# Altium project RT1064_MainBoard.PrjPcb
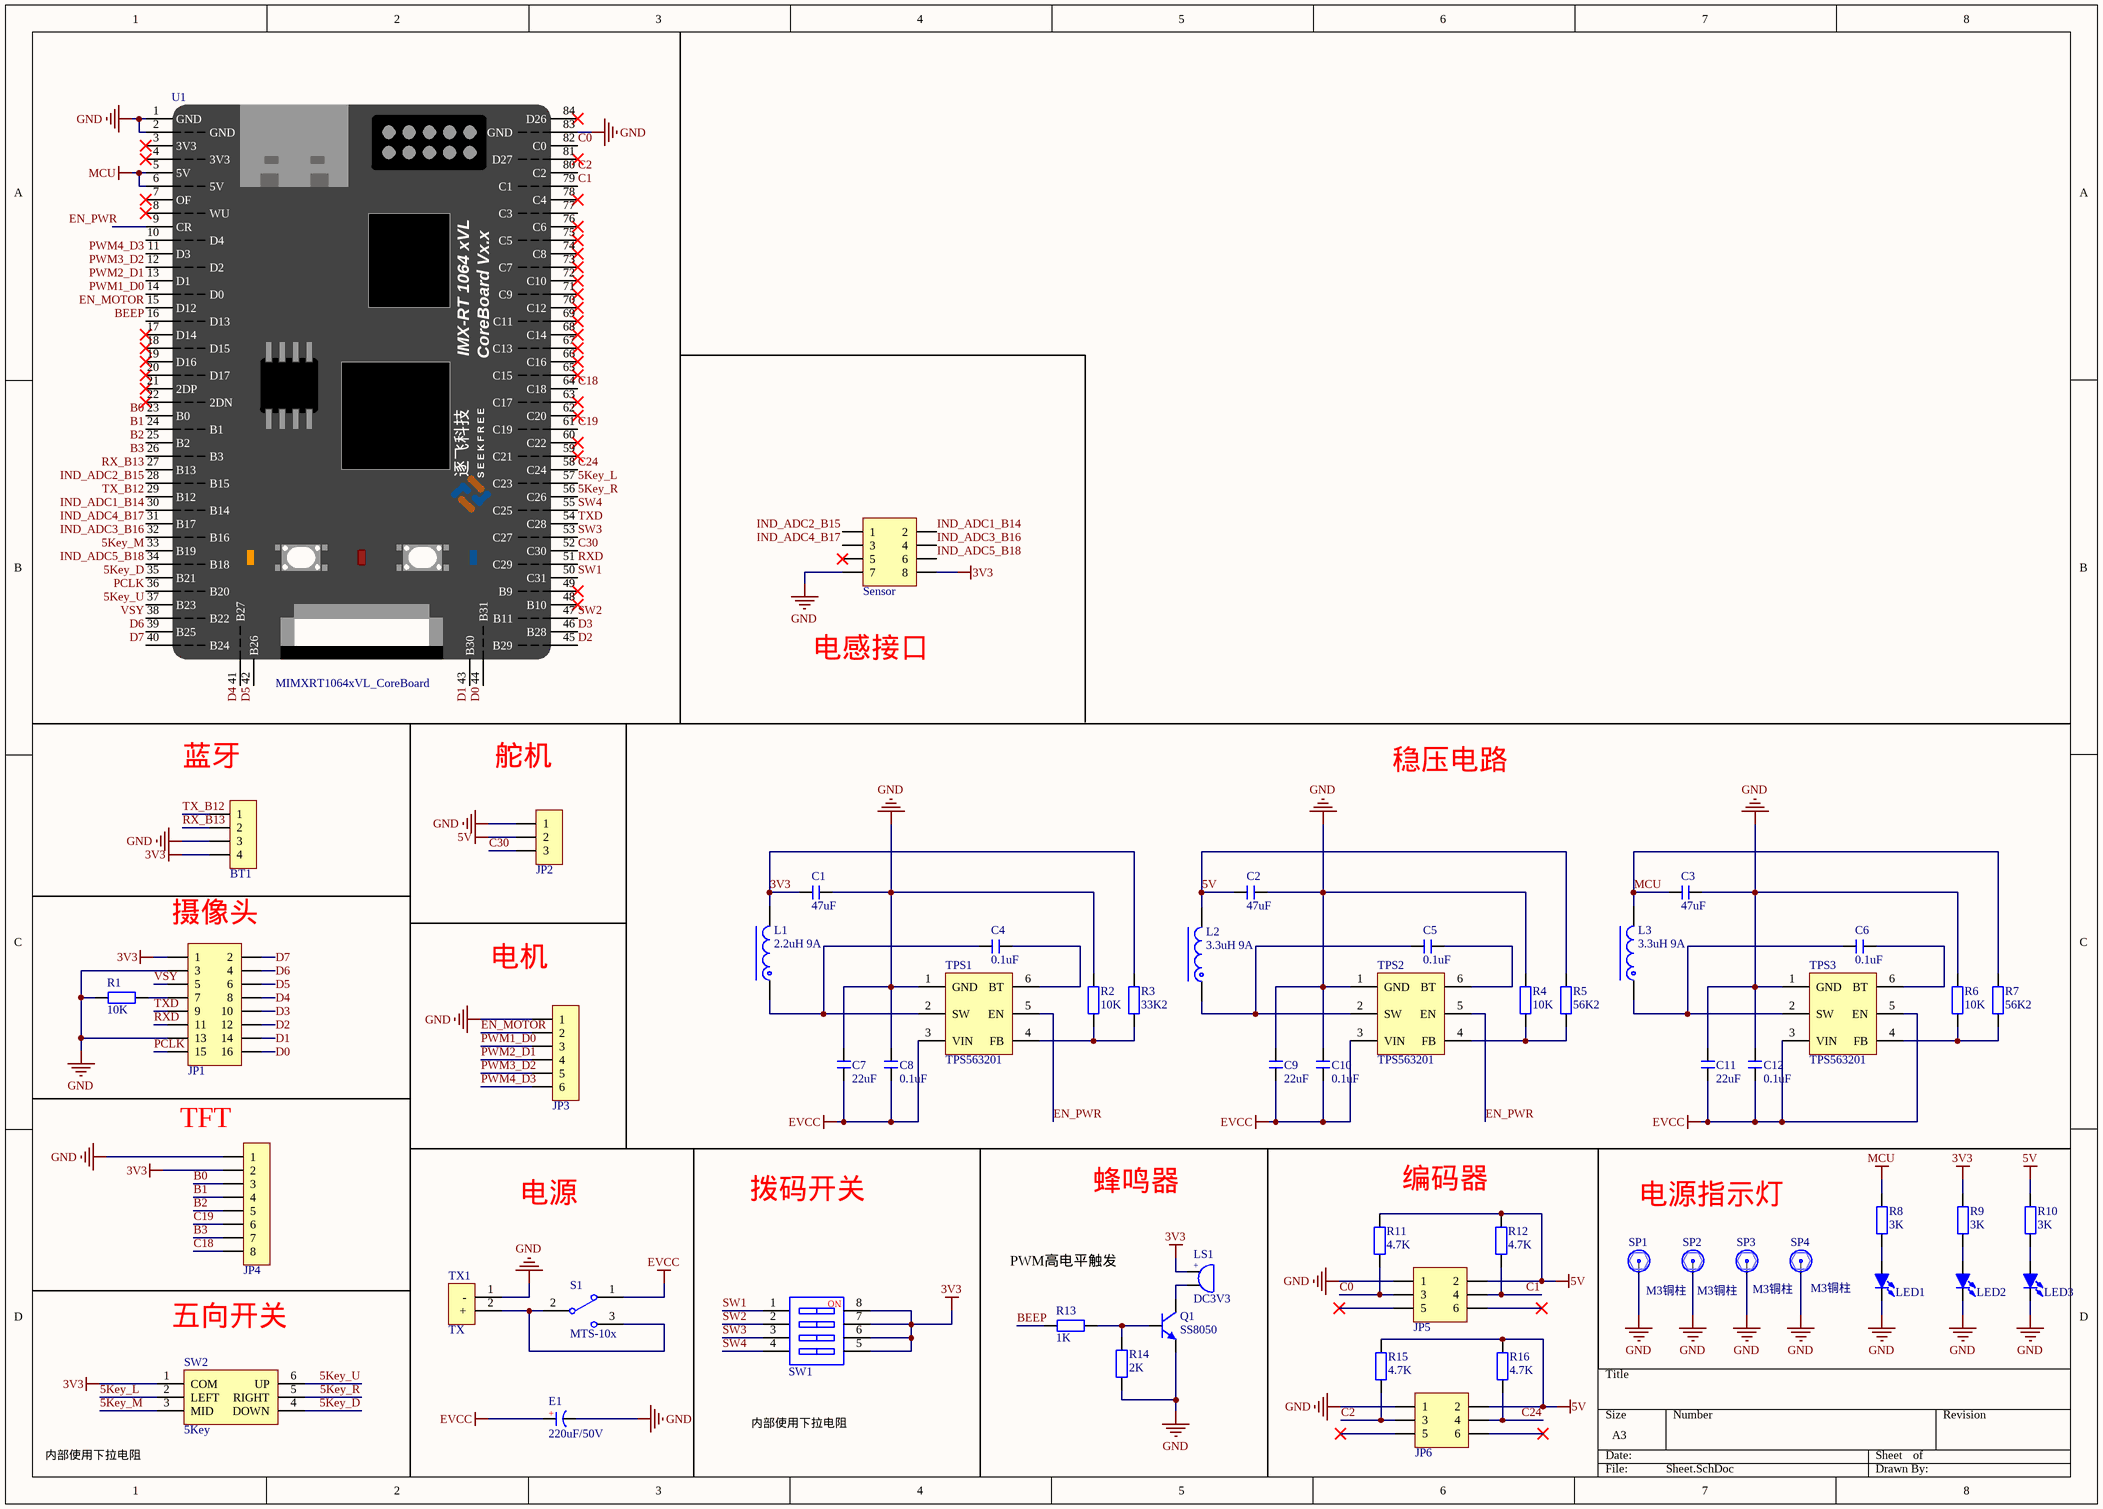
[diagram p0: Sheet.SchDoc]
1 sheet, 57 parts. Net scope: global (net labels, ports and power ports of the same name join across sheets).
Board file: PCB.PcbDoc

## Sheet Sheet.SchDoc
size A3

### Parts
BT1  HDR-1X4  [HDR2.54-M-LI-4P]  (value not drawn)
C1  47uF  [C 1206_M]
C2  47uF  [C 1206_M]
C3  47uF  [C 1206_M]
C4  0.1uF  [C 0603_M]
C5  0.1uF  [C 0603_M]
C6  0.1uF  [C 0603_M]
C7  22uF  [C 1206_M]
C8  0.1uF  [C 0603_M]
C9  22uF  [C 1206_M]
C10  0.1uF  [C 0603_M]
C11  22uF  [C 1206_M]
C12  0.1uF  [C 0603_M]
E1  220uF/50V  [CM F(10*10.2)]
JP1  Header 8X2  [HDR2.54-LI-2x8P]  (value not drawn)
JP2  HDR-1X3  [HDR2.54-WI-3P]  (value not drawn)
JP3  HDR-1X6  [HDR2.54-LI-6P]  (value not drawn)
JP4  HDR-1X8  [HDR2.54-M-LI-8P]  (value not drawn)
JP5  Header3X2  [HDR2.54-WI-2x3P]  (value not drawn)
JP6  Header3X2  [HDR2.54-WI-2x3P]  (value not drawn)
L1  2.2uH 9A  [L-SMD-0630]
L2  3.3uH 9A  [L-SMD-0630]
L3  3.3uH 9A  [L-SMD-0630]
LED1  红色  [LED 0805R]  (value not drawn)
LED2  红色  [LED 0805R]  (value not drawn)
LED3  红色  [LED 0805R]  (value not drawn)
LS1  DC3V3  [BEEP 4x9.6x5.5]
Q1  SS8050  [SOT23-3M]
R1  10K  [R 0603_M]
R2  10K  [R 0603_M]
R3  33K2  [R 0603_M]
R4  10K  [R 0603_M]
R5  56K2  [R 0603_M]
R6  10K  [R 0603_M]
R7  56K2  [R 0603_M]
R8  3K  [R 0603_M]
R9  3K  [R 0603_M]
R10  3K  [R 0603_M]
R11  4.7K  [R 0603_M]
R12  4.7K  [R 0603_M]
R13  1K  [R 0603_M]
R14  2K  [R 0603_M]
R15  4.7K  [R 0603_M]
R16  4.7K  [R 0603_M]
S1  MTS-10x  [MTS-10x]
Sensor  Header 4X2  [HDR-4X2]  (value not drawn)
SP1  M3铜柱  [M3x4_L]
SP2  M3铜柱  [M3x4_L]
SP3  M3铜柱  [M3x4_L]
SP4  M3铜柱  [M3x4_L]
SW1  CSW-4P  [CSW DIP-4P_G]  (value not drawn)
SW2  5Key  [TSW 10x10x9-5Key-LS]
TPS1  TPS563201  [SOT23-6N]
TPS2  TPS563201  [SOT23-6N]
TPS3  TPS563201  [SOT23-6N]
TX1  TX  [TX]
U1  MIMXRT1064xVL_CoreBoard  [MIMXRT1064xVL_CoreBoard]

### Nets
3V3: BT1.4 C1.1 JP1.1 JP4.2 L1.2 LS1.1 R3.2 R9.2 Sensor.8 SW1.5 SW1.6 SW1.7 SW1.8 SW2.1(COM)
5V: C2.1 JP2.2 JP5.2 JP6.2 L2.2 R5.2 R10.2 R11.2 R12.2 R15.2 R16.2
EVCC: C7.1 C8.1 C9.1 C10.1 C11.1 C12.1 E1.1(A) S1.1 TPS1.3(VIN) TPS2.3(VIN) TPS3.3(VIN) TPS3.5(EN)
GND: BT1.3 C1.2 C2.2 C3.2 C7.2 C8.2 C9.2 C10.2 C11.2 C12.2 E1.2(K) JP1.3 JP1.13 JP2.1 JP3.1 JP4.1 JP5.1 JP6.1 LED1.2(K) LED2.2(K) LED3.2(K) Q1.2(E) R1.1 R2.2 R4.2 R6.2 R14.1 Sensor.7 SP1.1 SP2.1 SP3.1 SP4.1 TPS1.1(GND) TPS2.1(GND) TPS3.1(GND) TX1.1(-) U1.1(GND) U1.2(GND) U1.83(GND)
MCU: C3.1 L3.2 R7.2 R8.2 U1.5(5V) U1.6(5V)
5Key_D: SW2.4(DOWN) U1.35(B21)
5Key_L: SW2.2(LEFT) U1.57(C23)
5Key_M: SW2.3(MID) U1.33(B19)
5Key_R: SW2.5(RIGHT) U1.56(C26)
5Key_U: SW2.6(UP) U1.37(B23)
B0: JP4.3 U1.23(B0)
B1: JP4.4 U1.24(B1)
B2: JP4.5 U1.25(B2)
B3: JP4.7 U1.26(B3)
BEEP: R13.1 U1.16(D13)
C0: JP5.3 R11.1 U1.82(C0)
C1: JP5.4 R12.1 U1.79(C1)
C2: JP6.3 R15.1 U1.80(C2)
C18: JP4.8 U1.64(C18)
C19: JP4.6 U1.61(C19)
C24: JP6.4 R16.1 U1.58(C24)
C30: JP2.3 U1.52(C30)
D0: JP1.16 U1.44(B31)
D1: JP1.14 U1.43(B30)
D2: JP1.12 U1.45(B29)
D3: JP1.10 U1.46(B28)
D4: JP1.8 U1.41(B27)
D5: JP1.6 U1.42(B26)
D6: JP1.4 U1.39(B25)
D7: JP1.2 U1.40(B24)
EN_MOTOR: JP3.2 U1.15(D12)
EN_PWR: TPS1.5(EN) TPS2.5(EN) U1.9(CR)
IND_ADC1_B14: Sensor.2 U1.30(B14)
IND_ADC2_B15: Sensor.1 U1.28(B15)
IND_ADC3_B16: Sensor.4 U1.32(B16)
IND_ADC4_B17: Sensor.3 U1.31(B17)
IND_ADC5_B18: Sensor.6 U1.34(B18)
PCLK: JP1.15 U1.36(B20)
PWM1_D0: JP3.3 U1.14(D0)
PWM2_D1: JP3.4 U1.13(D1)
PWM3_D2: JP3.5 U1.12(D2)
PWM4_D3: JP3.6 U1.11(D3)
RX_B13: BT1.2 U1.27(B13)
RXD: JP1.11 U1.51(C29)
SW1: SW1.1 U1.50(C31)
SW2: SW1.2 U1.47(B11)
SW3: SW1.3 U1.53(C27)
SW4: SW1.4 U1.55(C25)
TX_B12: BT1.1 U1.29(B12)
TXD: JP1.9 U1.54(C28)
VSY: JP1.5 U1.38(B22)
NetC4_1: C4.1 L1.1 TPS1.2(SW)
NetC4_2: C4.2 TPS1.6(BT)
NetC5_1: C5.1 L2.1 TPS2.2(SW)
NetC5_2: C5.2 TPS2.6(BT)
NetC6_1: C6.1 L3.1 TPS3.2(SW)
NetC6_2: C6.2 TPS3.6(BT)
NetJP1_7: JP1.7 R1.2
NetLED1_1: LED1.1(A) R8.1
NetLED2_1: LED2.1(A) R9.1
NetLED3_1: LED3.1(A) R10.1
NetLS1_2: LS1.2 Q1.3(C)
NetQ1_1: Q1.1(B) R13.2 R14.2
NetR2_1: R2.1 R3.1 TPS1.4(FB)
NetR4_1: R4.1 R5.1 TPS2.4(FB)
NetR6_1: R6.1 R7.1 TPS3.4(FB)
NetS1_2: S1.2 S1.3 TX1.2(+)

Not connected (* = marked no-connect by the designer): JP5 5* 6*; JP6 5* 6*; Sensor 5*; U1 3(3V3)* 4(3V3)* 7(OF)* 8(WU)* 10(D4) 17(D14)* 18(D15)* 19(D16)* 20(D17)* 21(2DP)* 22(2DN)* 48(B10)* 49(B9)* 59(C21)* 60(C22)* 62(C20)* 63(C17)* 65(C15)* 66(C16)* 67(C13)* 68(C14)* 69(C11)* 70(C12)* 71(C9)* 72(C10)* 73(C7)* 74(C8)* 75(C5)* 76(C6)* 77(C3) 78(C4)* 81(D27)* 84(D26)*

### Notes on the sheet
- 电感接口
- (near BT1) 蓝牙
- (near JP2) 舵机
- 稳压电路
- (near JP1) 摄像头
- 电机
- (near JP4) TFT
- 蜂鸣器
- (near R11) 编码器
- 电源
- 拨码开关
- 电源指示灯
- 五向开关
- PWM高电平触发
- 内部使用下拉电阻
- (in symbol BEEP) +
- (in symbol C-CM) +
- (in symbol CSW-4P) NO
- (in symbol MIMXRT1064xVL_CoreBoard) IMX-RT 1064 xVL; CoreBoard Vx.x; 逐飞科技; S E E K F R E E

### Library data of the parts
BT1 = Header 4: 4P接插件; 版权归属: 源创客; BOM名称: 4P接插件; 学习资源: www.ooocke.com
C1-C3 = C_2: 无极性贴片电容; 版权归属: 源创客; BOM名称: 无极性贴片电容; 学习资源: www.ooocke.com
C4-C6 C8 C10 C12 = C_1: 无极性贴片电容; 版权归属: 源创客; BOM名称: 无极性贴片电容; 学习资源: www.ooocke.com
C7 C9 C11 = C: 无极性贴片电容; 版权归属: 源创客; BOM名称: 无极性贴片电容; 学习资源: www.ooocke.com
E1 = C-CM: 贴片电解电容; 版权归属: 源创客; BOM名称: 贴片电解电容; 学习资源: www.ooocke.com
JP1 = Header 8X2: 8*2P接插件; 版权归属: 源创客; BOM名称: 8*2P接插件; 学习资源: www.ooocke.com
JP2 = Header 3: 3P接插件; 版权归属: 源创客; BOM名称: 3P接插件; 学习资源: www.ooocke.com
JP3 = Header 6: 6P接插件; 版权归属: 源创客; BOM名称: 6P接插件; 学习资源: www.ooocke.com
JP4 = Header 8: 8P接插件; 版权归属: 源创客; BOM名称: 8P接插件; 学习资源: www.ooocke.com
JP5 JP6 = Header 3X2: 3*2P接插件; 版权归属: 源创客; BOM名称: 3*2P接插件; 学习资源: www.ooocke.com
L1 = Inductor0630: 功率屏蔽电感; 版权归属: 源创客; BOM名称: 功率屏蔽电感; 学习资源: www.ooocke.com
L2 L3 = Inductor0630_1: 功率屏蔽电感; 版权归属: 源创客; BOM名称: 功率屏蔽电感; 学习资源: www.ooocke.com
LED1-LED3 = LED-SMD: 贴片LED; 版权归属: 源创客; BOM名称: 贴片LED; 学习资源: www.ooocke.com
LS1 = BEEP: 蜂鸣器; 版权归属: 源创客; BOM名称: 蜂鸣器; 学习资源: www.ooocke.com
Q1 = 8050-SMD: 高频放大-NPN型; 版权归属: 源创客; 属性: 40V 1.5A 1W 100MHZ; BOM名称: 高频放大-NPN型; 学习资源: www.ooocke.com
R1 R2 R4 R6 = R_1: 贴片电阻; 版权归属: 源创客; BOM名称: 贴片电阻; 学习资源: www.ooocke.com
R3 = R_2: 贴片电阻; 版权归属: 源创客; BOM名称: 贴片电阻; 学习资源: www.ooocke.com
R5 R7 = R_3: 贴片电阻; 版权归属: 源创客; BOM名称: 贴片电阻; 学习资源: www.ooocke.com
R8-R10 = R_7: 贴片电阻; 版权归属: 源创客; BOM名称: 贴片电阻; 学习资源: www.ooocke.com
R11 R12 R15 R16 = R: 贴片电阻; 版权归属: 源创客; BOM名称: 贴片电阻; 学习资源: www.ooocke.com
R13 = R_5: 贴片电阻; 版权归属: 源创客; BOM名称: 贴片电阻; 学习资源: www.ooocke.com
R14 = R_6: 贴片电阻; 版权归属: 源创客; BOM名称: 贴片电阻; 学习资源: www.ooocke.com
S1 = MTS-10x: MTS10x系列3脚扭子开关; 版权归属: 源创客; BOM名称: MTS10x系列3脚扭子开关; 学习资源: www.ooocke.com
Sensor = Header 4X2: 4*2P接插件; 版权归属: 源创客; BOM名称: 4*2P接插件; 学习资源: www.ooocke.com
SP1-SP4 = 铜柱小焊盘: 铜柱; 版权归属: 源创客; BOM名称: 铜柱; 学习资源: www.ooocke.com
SW1 = CSW-4P: 4路编码开关; 版权归属: 源创客; BOM名称: 4路编码开关; 学习资源: www.ooocke.com
TPS1-TPS3 = TPS54302
TX1 = T型插头
U1 = MIMXRT1064xVL_CoreBoard: 逐飞科技i.MX RT1064核心板整体原理，可直接使用